# Altium schematic sheet Top.SchDoc
size A4
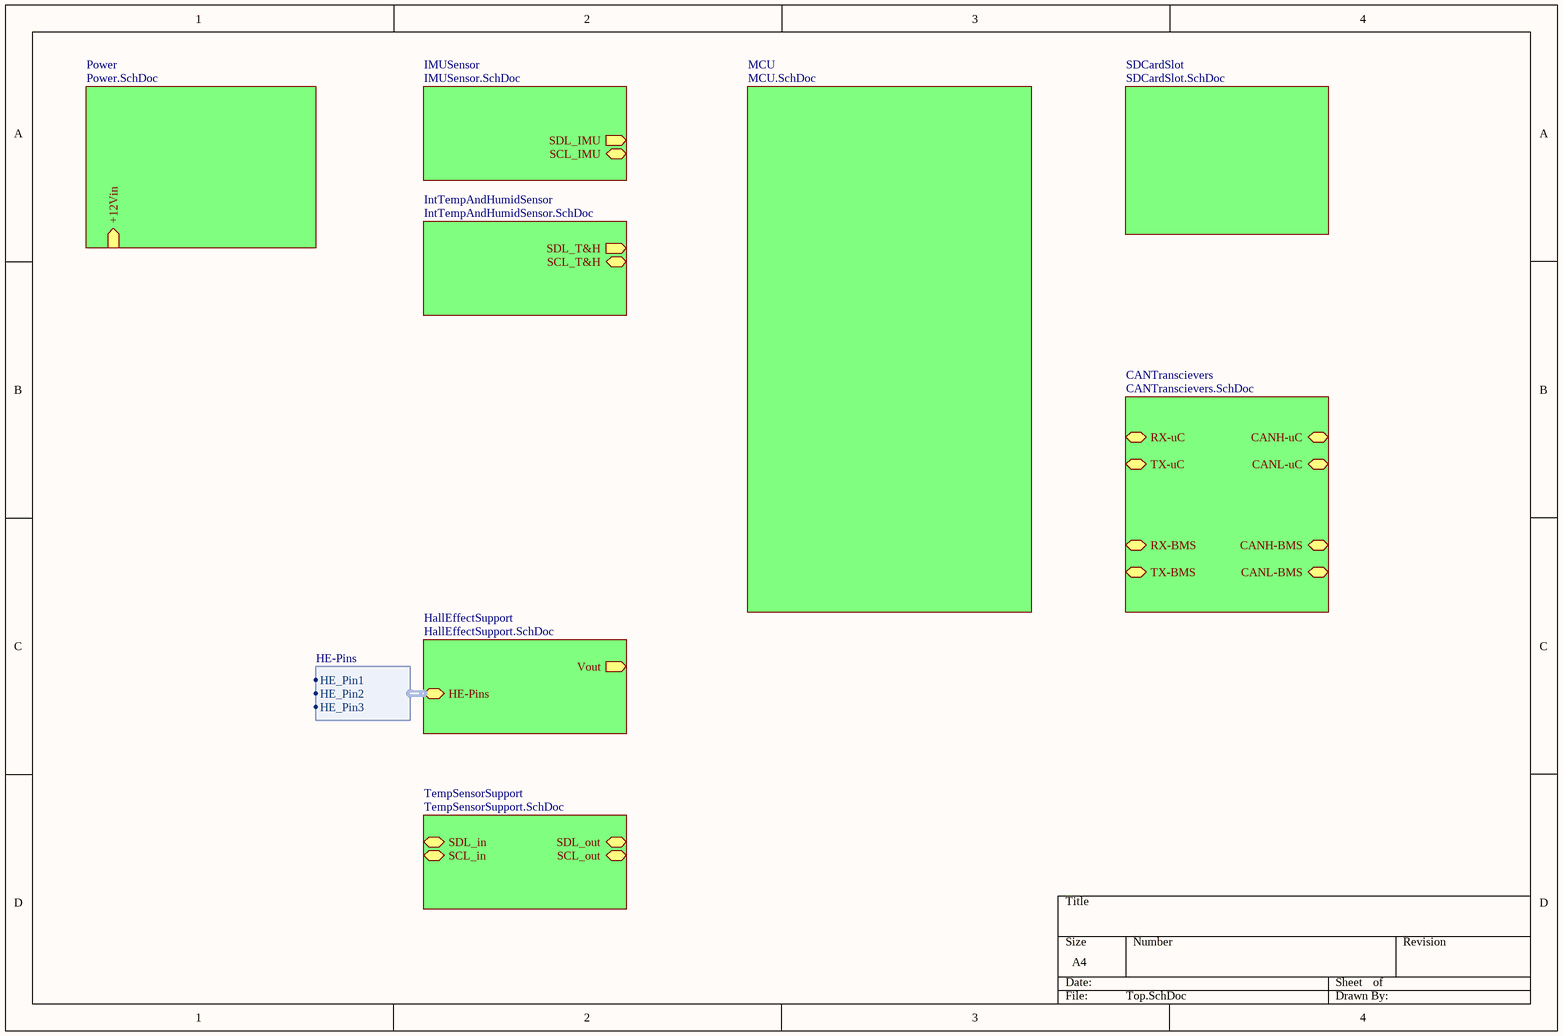
[diagram p0: Top.SchDoc]

## Sub-sheets
CANTranscievers = CANTranscievers.SchDoc: RX-BMS, TX-BMS, RX-uC, TX-uC, CANH-uC, CANL-uC, CANH-BMS, CANL-BMS
HallEffectSupport = HallEffectSupport.SchDoc: HE-Pins (harness HE-Pins), Vout (out)
IMUSensor = IMUSensor.SchDoc: SDL_IMU (out), SCL_IMU
IntTempAndHumidSensor = IntTempAndHumidSensor.SchDoc: SDL_T&H (out), SCL_T&H
MCU = MCU.SchDoc: no entries
Power = Power.SchDoc: +12Vin (in)
SDCardSlot = SDCardSlot.SchDoc: no entries
TempSensorSupport = TempSensorSupport.SchDoc: SDL_in, SCL_in, SDL_out, SCL_out

## Harnesses
HE-Pins: HE_Pin1, HE_Pin2, HE_Pin3